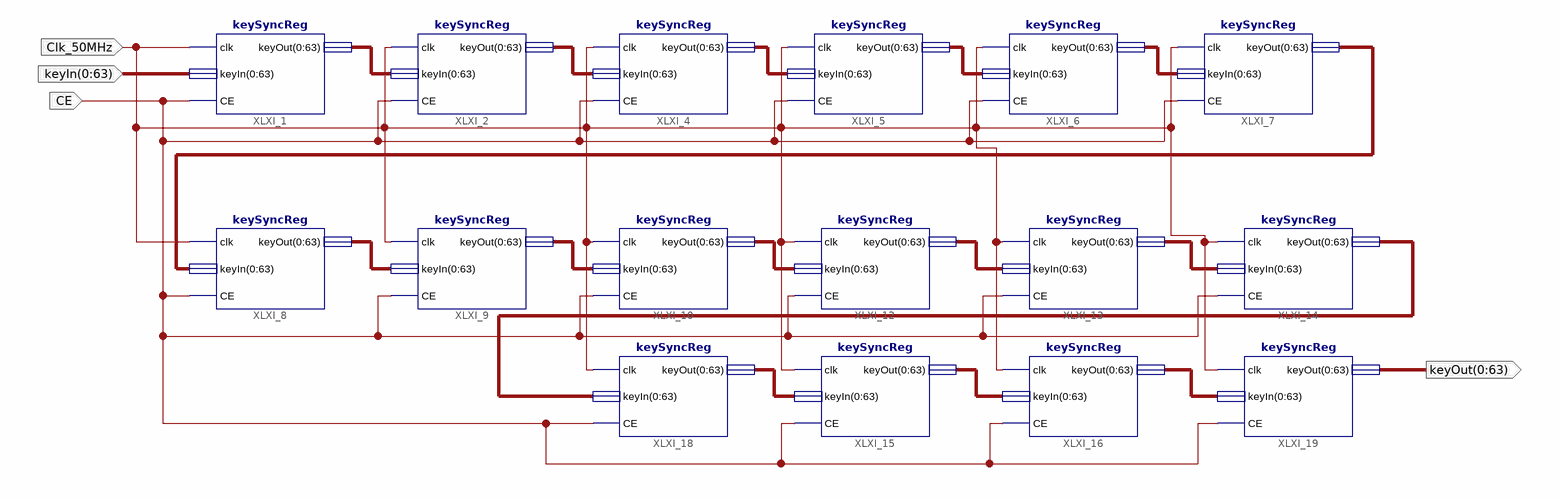
[diagram p0: schematic sheet 1]
// Xilinx ISE schematic keyBuffer.sch (spartan3e) as structural Verilog: 16 symbols, 4 ports
module keyBuffer (
  input  [0:63] keyIn,
  input  Clk_50MHz,
  input  CE,
  output [0:63] keyOut
);

  wire [63:0] XLXN_4, XLXN_5, XLXN_6, XLXN_9, XLXN_10, XLXN_11, XLXN_13, XLXN_14, XLXN_15, XLXN_16, XLXN_17,
       XLXN_18, XLXN_20, XLXN_21, XLXN_56;

  keySyncReg XLXI_1 (
    .clk(Clk_50MHz), .keyIn(keyIn),
    .keyOut({XLXN_4[0], XLXN_4[1], XLXN_4[2], XLXN_4[3], XLXN_4[4], XLXN_4[5], XLXN_4[6], XLXN_4[7], XLXN_4[8], XLXN_4[9], XLXN_4[10], XLXN_4[11], XLXN_4[12], XLXN_4[13], XLXN_4[14], XLXN_4[15], XLXN_4[16], XLXN_4[17], XLXN_4[18], XLXN_4[19], XLXN_4[20], XLXN_4[21], XLXN_4[22], XLXN_4[23], XLXN_4[24], XLXN_4[25], XLXN_4[26], XLXN_4[27], XLXN_4[28], XLXN_4[29], XLXN_4[30], XLXN_4[31], XLXN_4[32], XLXN_4[33], XLXN_4[34], XLXN_4[35], XLXN_4[36], XLXN_4[37], XLXN_4[38], XLXN_4[39], XLXN_4[40], XLXN_4[41], XLXN_4[42], XLXN_4[43], XLXN_4[44], XLXN_4[45], XLXN_4[46], XLXN_4[47], XLXN_4[48], XLXN_4[49], XLXN_4[50], XLXN_4[51], XLXN_4[52], XLXN_4[53], XLXN_4[54], XLXN_4[55], XLXN_4[56], XLXN_4[57], XLXN_4[58], XLXN_4[59], XLXN_4[60], XLXN_4[61], XLXN_4[62], XLXN_4[63]}),
    .CE(CE));
  keySyncReg XLXI_2 (
    .clk(Clk_50MHz),
    .keyIn({XLXN_4[0], XLXN_4[1], XLXN_4[2], XLXN_4[3], XLXN_4[4], XLXN_4[5], XLXN_4[6], XLXN_4[7], XLXN_4[8], XLXN_4[9], XLXN_4[10], XLXN_4[11], XLXN_4[12], XLXN_4[13], XLXN_4[14], XLXN_4[15], XLXN_4[16], XLXN_4[17], XLXN_4[18], XLXN_4[19], XLXN_4[20], XLXN_4[21], XLXN_4[22], XLXN_4[23], XLXN_4[24], XLXN_4[25], XLXN_4[26], XLXN_4[27], XLXN_4[28], XLXN_4[29], XLXN_4[30], XLXN_4[31], XLXN_4[32], XLXN_4[33], XLXN_4[34], XLXN_4[35], XLXN_4[36], XLXN_4[37], XLXN_4[38], XLXN_4[39], XLXN_4[40], XLXN_4[41], XLXN_4[42], XLXN_4[43], XLXN_4[44], XLXN_4[45], XLXN_4[46], XLXN_4[47], XLXN_4[48], XLXN_4[49], XLXN_4[50], XLXN_4[51], XLXN_4[52], XLXN_4[53], XLXN_4[54], XLXN_4[55], XLXN_4[56], XLXN_4[57], XLXN_4[58], XLXN_4[59], XLXN_4[60], XLXN_4[61], XLXN_4[62], XLXN_4[63]}),
    .keyOut({XLXN_5[0], XLXN_5[1], XLXN_5[2], XLXN_5[3], XLXN_5[4], XLXN_5[5], XLXN_5[6], XLXN_5[7], XLXN_5[8], XLXN_5[9], XLXN_5[10], XLXN_5[11], XLXN_5[12], XLXN_5[13], XLXN_5[14], XLXN_5[15], XLXN_5[16], XLXN_5[17], XLXN_5[18], XLXN_5[19], XLXN_5[20], XLXN_5[21], XLXN_5[22], XLXN_5[23], XLXN_5[24], XLXN_5[25], XLXN_5[26], XLXN_5[27], XLXN_5[28], XLXN_5[29], XLXN_5[30], XLXN_5[31], XLXN_5[32], XLXN_5[33], XLXN_5[34], XLXN_5[35], XLXN_5[36], XLXN_5[37], XLXN_5[38], XLXN_5[39], XLXN_5[40], XLXN_5[41], XLXN_5[42], XLXN_5[43], XLXN_5[44], XLXN_5[45], XLXN_5[46], XLXN_5[47], XLXN_5[48], XLXN_5[49], XLXN_5[50], XLXN_5[51], XLXN_5[52], XLXN_5[53], XLXN_5[54], XLXN_5[55], XLXN_5[56], XLXN_5[57], XLXN_5[58], XLXN_5[59], XLXN_5[60], XLXN_5[61], XLXN_5[62], XLXN_5[63]}),
    .CE(CE));
  keySyncReg XLXI_4 (
    .clk(Clk_50MHz),
    .keyIn({XLXN_5[0], XLXN_5[1], XLXN_5[2], XLXN_5[3], XLXN_5[4], XLXN_5[5], XLXN_5[6], XLXN_5[7], XLXN_5[8], XLXN_5[9], XLXN_5[10], XLXN_5[11], XLXN_5[12], XLXN_5[13], XLXN_5[14], XLXN_5[15], XLXN_5[16], XLXN_5[17], XLXN_5[18], XLXN_5[19], XLXN_5[20], XLXN_5[21], XLXN_5[22], XLXN_5[23], XLXN_5[24], XLXN_5[25], XLXN_5[26], XLXN_5[27], XLXN_5[28], XLXN_5[29], XLXN_5[30], XLXN_5[31], XLXN_5[32], XLXN_5[33], XLXN_5[34], XLXN_5[35], XLXN_5[36], XLXN_5[37], XLXN_5[38], XLXN_5[39], XLXN_5[40], XLXN_5[41], XLXN_5[42], XLXN_5[43], XLXN_5[44], XLXN_5[45], XLXN_5[46], XLXN_5[47], XLXN_5[48], XLXN_5[49], XLXN_5[50], XLXN_5[51], XLXN_5[52], XLXN_5[53], XLXN_5[54], XLXN_5[55], XLXN_5[56], XLXN_5[57], XLXN_5[58], XLXN_5[59], XLXN_5[60], XLXN_5[61], XLXN_5[62], XLXN_5[63]}),
    .keyOut({XLXN_6[0], XLXN_6[1], XLXN_6[2], XLXN_6[3], XLXN_6[4], XLXN_6[5], XLXN_6[6], XLXN_6[7], XLXN_6[8], XLXN_6[9], XLXN_6[10], XLXN_6[11], XLXN_6[12], XLXN_6[13], XLXN_6[14], XLXN_6[15], XLXN_6[16], XLXN_6[17], XLXN_6[18], XLXN_6[19], XLXN_6[20], XLXN_6[21], XLXN_6[22], XLXN_6[23], XLXN_6[24], XLXN_6[25], XLXN_6[26], XLXN_6[27], XLXN_6[28], XLXN_6[29], XLXN_6[30], XLXN_6[31], XLXN_6[32], XLXN_6[33], XLXN_6[34], XLXN_6[35], XLXN_6[36], XLXN_6[37], XLXN_6[38], XLXN_6[39], XLXN_6[40], XLXN_6[41], XLXN_6[42], XLXN_6[43], XLXN_6[44], XLXN_6[45], XLXN_6[46], XLXN_6[47], XLXN_6[48], XLXN_6[49], XLXN_6[50], XLXN_6[51], XLXN_6[52], XLXN_6[53], XLXN_6[54], XLXN_6[55], XLXN_6[56], XLXN_6[57], XLXN_6[58], XLXN_6[59], XLXN_6[60], XLXN_6[61], XLXN_6[62], XLXN_6[63]}),
    .CE(CE));
  keySyncReg XLXI_5 (
    .clk(Clk_50MHz),
    .keyIn({XLXN_6[0], XLXN_6[1], XLXN_6[2], XLXN_6[3], XLXN_6[4], XLXN_6[5], XLXN_6[6], XLXN_6[7], XLXN_6[8], XLXN_6[9], XLXN_6[10], XLXN_6[11], XLXN_6[12], XLXN_6[13], XLXN_6[14], XLXN_6[15], XLXN_6[16], XLXN_6[17], XLXN_6[18], XLXN_6[19], XLXN_6[20], XLXN_6[21], XLXN_6[22], XLXN_6[23], XLXN_6[24], XLXN_6[25], XLXN_6[26], XLXN_6[27], XLXN_6[28], XLXN_6[29], XLXN_6[30], XLXN_6[31], XLXN_6[32], XLXN_6[33], XLXN_6[34], XLXN_6[35], XLXN_6[36], XLXN_6[37], XLXN_6[38], XLXN_6[39], XLXN_6[40], XLXN_6[41], XLXN_6[42], XLXN_6[43], XLXN_6[44], XLXN_6[45], XLXN_6[46], XLXN_6[47], XLXN_6[48], XLXN_6[49], XLXN_6[50], XLXN_6[51], XLXN_6[52], XLXN_6[53], XLXN_6[54], XLXN_6[55], XLXN_6[56], XLXN_6[57], XLXN_6[58], XLXN_6[59], XLXN_6[60], XLXN_6[61], XLXN_6[62], XLXN_6[63]}),
    .keyOut({XLXN_9[0], XLXN_9[1], XLXN_9[2], XLXN_9[3], XLXN_9[4], XLXN_9[5], XLXN_9[6], XLXN_9[7], XLXN_9[8], XLXN_9[9], XLXN_9[10], XLXN_9[11], XLXN_9[12], XLXN_9[13], XLXN_9[14], XLXN_9[15], XLXN_9[16], XLXN_9[17], XLXN_9[18], XLXN_9[19], XLXN_9[20], XLXN_9[21], XLXN_9[22], XLXN_9[23], XLXN_9[24], XLXN_9[25], XLXN_9[26], XLXN_9[27], XLXN_9[28], XLXN_9[29], XLXN_9[30], XLXN_9[31], XLXN_9[32], XLXN_9[33], XLXN_9[34], XLXN_9[35], XLXN_9[36], XLXN_9[37], XLXN_9[38], XLXN_9[39], XLXN_9[40], XLXN_9[41], XLXN_9[42], XLXN_9[43], XLXN_9[44], XLXN_9[45], XLXN_9[46], XLXN_9[47], XLXN_9[48], XLXN_9[49], XLXN_9[50], XLXN_9[51], XLXN_9[52], XLXN_9[53], XLXN_9[54], XLXN_9[55], XLXN_9[56], XLXN_9[57], XLXN_9[58], XLXN_9[59], XLXN_9[60], XLXN_9[61], XLXN_9[62], XLXN_9[63]}),
    .CE(CE));
  keySyncReg XLXI_6 (
    .clk(Clk_50MHz),
    .keyIn({XLXN_9[0], XLXN_9[1], XLXN_9[2], XLXN_9[3], XLXN_9[4], XLXN_9[5], XLXN_9[6], XLXN_9[7], XLXN_9[8], XLXN_9[9], XLXN_9[10], XLXN_9[11], XLXN_9[12], XLXN_9[13], XLXN_9[14], XLXN_9[15], XLXN_9[16], XLXN_9[17], XLXN_9[18], XLXN_9[19], XLXN_9[20], XLXN_9[21], XLXN_9[22], XLXN_9[23], XLXN_9[24], XLXN_9[25], XLXN_9[26], XLXN_9[27], XLXN_9[28], XLXN_9[29], XLXN_9[30], XLXN_9[31], XLXN_9[32], XLXN_9[33], XLXN_9[34], XLXN_9[35], XLXN_9[36], XLXN_9[37], XLXN_9[38], XLXN_9[39], XLXN_9[40], XLXN_9[41], XLXN_9[42], XLXN_9[43], XLXN_9[44], XLXN_9[45], XLXN_9[46], XLXN_9[47], XLXN_9[48], XLXN_9[49], XLXN_9[50], XLXN_9[51], XLXN_9[52], XLXN_9[53], XLXN_9[54], XLXN_9[55], XLXN_9[56], XLXN_9[57], XLXN_9[58], XLXN_9[59], XLXN_9[60], XLXN_9[61], XLXN_9[62], XLXN_9[63]}),
    .keyOut({XLXN_10[0], XLXN_10[1], XLXN_10[2], XLXN_10[3], XLXN_10[4], XLXN_10[5], XLXN_10[6], XLXN_10[7], XLXN_10[8], XLXN_10[9], XLXN_10[10], XLXN_10[11], XLXN_10[12], XLXN_10[13], XLXN_10[14], XLXN_10[15], XLXN_10[16], XLXN_10[17], XLXN_10[18], XLXN_10[19], XLXN_10[20], XLXN_10[21], XLXN_10[22], XLXN_10[23], XLXN_10[24], XLXN_10[25], XLXN_10[26], XLXN_10[27], XLXN_10[28], XLXN_10[29], XLXN_10[30], XLXN_10[31], XLXN_10[32], XLXN_10[33], XLXN_10[34], XLXN_10[35], XLXN_10[36], XLXN_10[37], XLXN_10[38], XLXN_10[39], XLXN_10[40], XLXN_10[41], XLXN_10[42], XLXN_10[43], XLXN_10[44], XLXN_10[45], XLXN_10[46], XLXN_10[47], XLXN_10[48], XLXN_10[49], XLXN_10[50], XLXN_10[51], XLXN_10[52], XLXN_10[53], XLXN_10[54], XLXN_10[55], XLXN_10[56], XLXN_10[57], XLXN_10[58], XLXN_10[59], XLXN_10[60], XLXN_10[61], XLXN_10[62], XLXN_10[63]}),
    .CE(CE));
  keySyncReg XLXI_7 (
    .clk(Clk_50MHz),
    .keyIn({XLXN_10[0], XLXN_10[1], XLXN_10[2], XLXN_10[3], XLXN_10[4], XLXN_10[5], XLXN_10[6], XLXN_10[7], XLXN_10[8], XLXN_10[9], XLXN_10[10], XLXN_10[11], XLXN_10[12], XLXN_10[13], XLXN_10[14], XLXN_10[15], XLXN_10[16], XLXN_10[17], XLXN_10[18], XLXN_10[19], XLXN_10[20], XLXN_10[21], XLXN_10[22], XLXN_10[23], XLXN_10[24], XLXN_10[25], XLXN_10[26], XLXN_10[27], XLXN_10[28], XLXN_10[29], XLXN_10[30], XLXN_10[31], XLXN_10[32], XLXN_10[33], XLXN_10[34], XLXN_10[35], XLXN_10[36], XLXN_10[37], XLXN_10[38], XLXN_10[39], XLXN_10[40], XLXN_10[41], XLXN_10[42], XLXN_10[43], XLXN_10[44], XLXN_10[45], XLXN_10[46], XLXN_10[47], XLXN_10[48], XLXN_10[49], XLXN_10[50], XLXN_10[51], XLXN_10[52], XLXN_10[53], XLXN_10[54], XLXN_10[55], XLXN_10[56], XLXN_10[57], XLXN_10[58], XLXN_10[59], XLXN_10[60], XLXN_10[61], XLXN_10[62], XLXN_10[63]}),
    .keyOut({XLXN_11[0], XLXN_11[1], XLXN_11[2], XLXN_11[3], XLXN_11[4], XLXN_11[5], XLXN_11[6], XLXN_11[7], XLXN_11[8], XLXN_11[9], XLXN_11[10], XLXN_11[11], XLXN_11[12], XLXN_11[13], XLXN_11[14], XLXN_11[15], XLXN_11[16], XLXN_11[17], XLXN_11[18], XLXN_11[19], XLXN_11[20], XLXN_11[21], XLXN_11[22], XLXN_11[23], XLXN_11[24], XLXN_11[25], XLXN_11[26], XLXN_11[27], XLXN_11[28], XLXN_11[29], XLXN_11[30], XLXN_11[31], XLXN_11[32], XLXN_11[33], XLXN_11[34], XLXN_11[35], XLXN_11[36], XLXN_11[37], XLXN_11[38], XLXN_11[39], XLXN_11[40], XLXN_11[41], XLXN_11[42], XLXN_11[43], XLXN_11[44], XLXN_11[45], XLXN_11[46], XLXN_11[47], XLXN_11[48], XLXN_11[49], XLXN_11[50], XLXN_11[51], XLXN_11[52], XLXN_11[53], XLXN_11[54], XLXN_11[55], XLXN_11[56], XLXN_11[57], XLXN_11[58], XLXN_11[59], XLXN_11[60], XLXN_11[61], XLXN_11[62], XLXN_11[63]}),
    .CE(CE));
  keySyncReg XLXI_8 (
    .clk(Clk_50MHz),
    .keyIn({XLXN_11[0], XLXN_11[1], XLXN_11[2], XLXN_11[3], XLXN_11[4], XLXN_11[5], XLXN_11[6], XLXN_11[7], XLXN_11[8], XLXN_11[9], XLXN_11[10], XLXN_11[11], XLXN_11[12], XLXN_11[13], XLXN_11[14], XLXN_11[15], XLXN_11[16], XLXN_11[17], XLXN_11[18], XLXN_11[19], XLXN_11[20], XLXN_11[21], XLXN_11[22], XLXN_11[23], XLXN_11[24], XLXN_11[25], XLXN_11[26], XLXN_11[27], XLXN_11[28], XLXN_11[29], XLXN_11[30], XLXN_11[31], XLXN_11[32], XLXN_11[33], XLXN_11[34], XLXN_11[35], XLXN_11[36], XLXN_11[37], XLXN_11[38], XLXN_11[39], XLXN_11[40], XLXN_11[41], XLXN_11[42], XLXN_11[43], XLXN_11[44], XLXN_11[45], XLXN_11[46], XLXN_11[47], XLXN_11[48], XLXN_11[49], XLXN_11[50], XLXN_11[51], XLXN_11[52], XLXN_11[53], XLXN_11[54], XLXN_11[55], XLXN_11[56], XLXN_11[57], XLXN_11[58], XLXN_11[59], XLXN_11[60], XLXN_11[61], XLXN_11[62], XLXN_11[63]}),
    .keyOut({XLXN_13[0], XLXN_13[1], XLXN_13[2], XLXN_13[3], XLXN_13[4], XLXN_13[5], XLXN_13[6], XLXN_13[7], XLXN_13[8], XLXN_13[9], XLXN_13[10], XLXN_13[11], XLXN_13[12], XLXN_13[13], XLXN_13[14], XLXN_13[15], XLXN_13[16], XLXN_13[17], XLXN_13[18], XLXN_13[19], XLXN_13[20], XLXN_13[21], XLXN_13[22], XLXN_13[23], XLXN_13[24], XLXN_13[25], XLXN_13[26], XLXN_13[27], XLXN_13[28], XLXN_13[29], XLXN_13[30], XLXN_13[31], XLXN_13[32], XLXN_13[33], XLXN_13[34], XLXN_13[35], XLXN_13[36], XLXN_13[37], XLXN_13[38], XLXN_13[39], XLXN_13[40], XLXN_13[41], XLXN_13[42], XLXN_13[43], XLXN_13[44], XLXN_13[45], XLXN_13[46], XLXN_13[47], XLXN_13[48], XLXN_13[49], XLXN_13[50], XLXN_13[51], XLXN_13[52], XLXN_13[53], XLXN_13[54], XLXN_13[55], XLXN_13[56], XLXN_13[57], XLXN_13[58], XLXN_13[59], XLXN_13[60], XLXN_13[61], XLXN_13[62], XLXN_13[63]}),
    .CE(CE));
  keySyncReg XLXI_9 (
    .clk(Clk_50MHz),
    .keyIn({XLXN_13[0], XLXN_13[1], XLXN_13[2], XLXN_13[3], XLXN_13[4], XLXN_13[5], XLXN_13[6], XLXN_13[7], XLXN_13[8], XLXN_13[9], XLXN_13[10], XLXN_13[11], XLXN_13[12], XLXN_13[13], XLXN_13[14], XLXN_13[15], XLXN_13[16], XLXN_13[17], XLXN_13[18], XLXN_13[19], XLXN_13[20], XLXN_13[21], XLXN_13[22], XLXN_13[23], XLXN_13[24], XLXN_13[25], XLXN_13[26], XLXN_13[27], XLXN_13[28], XLXN_13[29], XLXN_13[30], XLXN_13[31], XLXN_13[32], XLXN_13[33], XLXN_13[34], XLXN_13[35], XLXN_13[36], XLXN_13[37], XLXN_13[38], XLXN_13[39], XLXN_13[40], XLXN_13[41], XLXN_13[42], XLXN_13[43], XLXN_13[44], XLXN_13[45], XLXN_13[46], XLXN_13[47], XLXN_13[48], XLXN_13[49], XLXN_13[50], XLXN_13[51], XLXN_13[52], XLXN_13[53], XLXN_13[54], XLXN_13[55], XLXN_13[56], XLXN_13[57], XLXN_13[58], XLXN_13[59], XLXN_13[60], XLXN_13[61], XLXN_13[62], XLXN_13[63]}),
    .keyOut({XLXN_14[0], XLXN_14[1], XLXN_14[2], XLXN_14[3], XLXN_14[4], XLXN_14[5], XLXN_14[6], XLXN_14[7], XLXN_14[8], XLXN_14[9], XLXN_14[10], XLXN_14[11], XLXN_14[12], XLXN_14[13], XLXN_14[14], XLXN_14[15], XLXN_14[16], XLXN_14[17], XLXN_14[18], XLXN_14[19], XLXN_14[20], XLXN_14[21], XLXN_14[22], XLXN_14[23], XLXN_14[24], XLXN_14[25], XLXN_14[26], XLXN_14[27], XLXN_14[28], XLXN_14[29], XLXN_14[30], XLXN_14[31], XLXN_14[32], XLXN_14[33], XLXN_14[34], XLXN_14[35], XLXN_14[36], XLXN_14[37], XLXN_14[38], XLXN_14[39], XLXN_14[40], XLXN_14[41], XLXN_14[42], XLXN_14[43], XLXN_14[44], XLXN_14[45], XLXN_14[46], XLXN_14[47], XLXN_14[48], XLXN_14[49], XLXN_14[50], XLXN_14[51], XLXN_14[52], XLXN_14[53], XLXN_14[54], XLXN_14[55], XLXN_14[56], XLXN_14[57], XLXN_14[58], XLXN_14[59], XLXN_14[60], XLXN_14[61], XLXN_14[62], XLXN_14[63]}),
    .CE(CE));
  keySyncReg XLXI_10 (
    .clk(Clk_50MHz),
    .keyIn({XLXN_14[0], XLXN_14[1], XLXN_14[2], XLXN_14[3], XLXN_14[4], XLXN_14[5], XLXN_14[6], XLXN_14[7], XLXN_14[8], XLXN_14[9], XLXN_14[10], XLXN_14[11], XLXN_14[12], XLXN_14[13], XLXN_14[14], XLXN_14[15], XLXN_14[16], XLXN_14[17], XLXN_14[18], XLXN_14[19], XLXN_14[20], XLXN_14[21], XLXN_14[22], XLXN_14[23], XLXN_14[24], XLXN_14[25], XLXN_14[26], XLXN_14[27], XLXN_14[28], XLXN_14[29], XLXN_14[30], XLXN_14[31], XLXN_14[32], XLXN_14[33], XLXN_14[34], XLXN_14[35], XLXN_14[36], XLXN_14[37], XLXN_14[38], XLXN_14[39], XLXN_14[40], XLXN_14[41], XLXN_14[42], XLXN_14[43], XLXN_14[44], XLXN_14[45], XLXN_14[46], XLXN_14[47], XLXN_14[48], XLXN_14[49], XLXN_14[50], XLXN_14[51], XLXN_14[52], XLXN_14[53], XLXN_14[54], XLXN_14[55], XLXN_14[56], XLXN_14[57], XLXN_14[58], XLXN_14[59], XLXN_14[60], XLXN_14[61], XLXN_14[62], XLXN_14[63]}),
    .keyOut({XLXN_15[0], XLXN_15[1], XLXN_15[2], XLXN_15[3], XLXN_15[4], XLXN_15[5], XLXN_15[6], XLXN_15[7], XLXN_15[8], XLXN_15[9], XLXN_15[10], XLXN_15[11], XLXN_15[12], XLXN_15[13], XLXN_15[14], XLXN_15[15], XLXN_15[16], XLXN_15[17], XLXN_15[18], XLXN_15[19], XLXN_15[20], XLXN_15[21], XLXN_15[22], XLXN_15[23], XLXN_15[24], XLXN_15[25], XLXN_15[26], XLXN_15[27], XLXN_15[28], XLXN_15[29], XLXN_15[30], XLXN_15[31], XLXN_15[32], XLXN_15[33], XLXN_15[34], XLXN_15[35], XLXN_15[36], XLXN_15[37], XLXN_15[38], XLXN_15[39], XLXN_15[40], XLXN_15[41], XLXN_15[42], XLXN_15[43], XLXN_15[44], XLXN_15[45], XLXN_15[46], XLXN_15[47], XLXN_15[48], XLXN_15[49], XLXN_15[50], XLXN_15[51], XLXN_15[52], XLXN_15[53], XLXN_15[54], XLXN_15[55], XLXN_15[56], XLXN_15[57], XLXN_15[58], XLXN_15[59], XLXN_15[60], XLXN_15[61], XLXN_15[62], XLXN_15[63]}),
    .CE(CE));
  keySyncReg XLXI_12 (
    .clk(Clk_50MHz),
    .keyIn({XLXN_15[0], XLXN_15[1], XLXN_15[2], XLXN_15[3], XLXN_15[4], XLXN_15[5], XLXN_15[6], XLXN_15[7], XLXN_15[8], XLXN_15[9], XLXN_15[10], XLXN_15[11], XLXN_15[12], XLXN_15[13], XLXN_15[14], XLXN_15[15], XLXN_15[16], XLXN_15[17], XLXN_15[18], XLXN_15[19], XLXN_15[20], XLXN_15[21], XLXN_15[22], XLXN_15[23], XLXN_15[24], XLXN_15[25], XLXN_15[26], XLXN_15[27], XLXN_15[28], XLXN_15[29], XLXN_15[30], XLXN_15[31], XLXN_15[32], XLXN_15[33], XLXN_15[34], XLXN_15[35], XLXN_15[36], XLXN_15[37], XLXN_15[38], XLXN_15[39], XLXN_15[40], XLXN_15[41], XLXN_15[42], XLXN_15[43], XLXN_15[44], XLXN_15[45], XLXN_15[46], XLXN_15[47], XLXN_15[48], XLXN_15[49], XLXN_15[50], XLXN_15[51], XLXN_15[52], XLXN_15[53], XLXN_15[54], XLXN_15[55], XLXN_15[56], XLXN_15[57], XLXN_15[58], XLXN_15[59], XLXN_15[60], XLXN_15[61], XLXN_15[62], XLXN_15[63]}),
    .keyOut({XLXN_16[0], XLXN_16[1], XLXN_16[2], XLXN_16[3], XLXN_16[4], XLXN_16[5], XLXN_16[6], XLXN_16[7], XLXN_16[8], XLXN_16[9], XLXN_16[10], XLXN_16[11], XLXN_16[12], XLXN_16[13], XLXN_16[14], XLXN_16[15], XLXN_16[16], XLXN_16[17], XLXN_16[18], XLXN_16[19], XLXN_16[20], XLXN_16[21], XLXN_16[22], XLXN_16[23], XLXN_16[24], XLXN_16[25], XLXN_16[26], XLXN_16[27], XLXN_16[28], XLXN_16[29], XLXN_16[30], XLXN_16[31], XLXN_16[32], XLXN_16[33], XLXN_16[34], XLXN_16[35], XLXN_16[36], XLXN_16[37], XLXN_16[38], XLXN_16[39], XLXN_16[40], XLXN_16[41], XLXN_16[42], XLXN_16[43], XLXN_16[44], XLXN_16[45], XLXN_16[46], XLXN_16[47], XLXN_16[48], XLXN_16[49], XLXN_16[50], XLXN_16[51], XLXN_16[52], XLXN_16[53], XLXN_16[54], XLXN_16[55], XLXN_16[56], XLXN_16[57], XLXN_16[58], XLXN_16[59], XLXN_16[60], XLXN_16[61], XLXN_16[62], XLXN_16[63]}),
    .CE(CE));
  keySyncReg XLXI_13 (
    .clk(Clk_50MHz),
    .keyIn({XLXN_16[0], XLXN_16[1], XLXN_16[2], XLXN_16[3], XLXN_16[4], XLXN_16[5], XLXN_16[6], XLXN_16[7], XLXN_16[8], XLXN_16[9], XLXN_16[10], XLXN_16[11], XLXN_16[12], XLXN_16[13], XLXN_16[14], XLXN_16[15], XLXN_16[16], XLXN_16[17], XLXN_16[18], XLXN_16[19], XLXN_16[20], XLXN_16[21], XLXN_16[22], XLXN_16[23], XLXN_16[24], XLXN_16[25], XLXN_16[26], XLXN_16[27], XLXN_16[28], XLXN_16[29], XLXN_16[30], XLXN_16[31], XLXN_16[32], XLXN_16[33], XLXN_16[34], XLXN_16[35], XLXN_16[36], XLXN_16[37], XLXN_16[38], XLXN_16[39], XLXN_16[40], XLXN_16[41], XLXN_16[42], XLXN_16[43], XLXN_16[44], XLXN_16[45], XLXN_16[46], XLXN_16[47], XLXN_16[48], XLXN_16[49], XLXN_16[50], XLXN_16[51], XLXN_16[52], XLXN_16[53], XLXN_16[54], XLXN_16[55], XLXN_16[56], XLXN_16[57], XLXN_16[58], XLXN_16[59], XLXN_16[60], XLXN_16[61], XLXN_16[62], XLXN_16[63]}),
    .keyOut({XLXN_17[0], XLXN_17[1], XLXN_17[2], XLXN_17[3], XLXN_17[4], XLXN_17[5], XLXN_17[6], XLXN_17[7], XLXN_17[8], XLXN_17[9], XLXN_17[10], XLXN_17[11], XLXN_17[12], XLXN_17[13], XLXN_17[14], XLXN_17[15], XLXN_17[16], XLXN_17[17], XLXN_17[18], XLXN_17[19], XLXN_17[20], XLXN_17[21], XLXN_17[22], XLXN_17[23], XLXN_17[24], XLXN_17[25], XLXN_17[26], XLXN_17[27], XLXN_17[28], XLXN_17[29], XLXN_17[30], XLXN_17[31], XLXN_17[32], XLXN_17[33], XLXN_17[34], XLXN_17[35], XLXN_17[36], XLXN_17[37], XLXN_17[38], XLXN_17[39], XLXN_17[40], XLXN_17[41], XLXN_17[42], XLXN_17[43], XLXN_17[44], XLXN_17[45], XLXN_17[46], XLXN_17[47], XLXN_17[48], XLXN_17[49], XLXN_17[50], XLXN_17[51], XLXN_17[52], XLXN_17[53], XLXN_17[54], XLXN_17[55], XLXN_17[56], XLXN_17[57], XLXN_17[58], XLXN_17[59], XLXN_17[60], XLXN_17[61], XLXN_17[62], XLXN_17[63]}),
    .CE(CE));
  keySyncReg XLXI_14 (
    .clk(Clk_50MHz),
    .keyIn({XLXN_17[0], XLXN_17[1], XLXN_17[2], XLXN_17[3], XLXN_17[4], XLXN_17[5], XLXN_17[6], XLXN_17[7], XLXN_17[8], XLXN_17[9], XLXN_17[10], XLXN_17[11], XLXN_17[12], XLXN_17[13], XLXN_17[14], XLXN_17[15], XLXN_17[16], XLXN_17[17], XLXN_17[18], XLXN_17[19], XLXN_17[20], XLXN_17[21], XLXN_17[22], XLXN_17[23], XLXN_17[24], XLXN_17[25], XLXN_17[26], XLXN_17[27], XLXN_17[28], XLXN_17[29], XLXN_17[30], XLXN_17[31], XLXN_17[32], XLXN_17[33], XLXN_17[34], XLXN_17[35], XLXN_17[36], XLXN_17[37], XLXN_17[38], XLXN_17[39], XLXN_17[40], XLXN_17[41], XLXN_17[42], XLXN_17[43], XLXN_17[44], XLXN_17[45], XLXN_17[46], XLXN_17[47], XLXN_17[48], XLXN_17[49], XLXN_17[50], XLXN_17[51], XLXN_17[52], XLXN_17[53], XLXN_17[54], XLXN_17[55], XLXN_17[56], XLXN_17[57], XLXN_17[58], XLXN_17[59], XLXN_17[60], XLXN_17[61], XLXN_17[62], XLXN_17[63]}),
    .keyOut({XLXN_18[0], XLXN_18[1], XLXN_18[2], XLXN_18[3], XLXN_18[4], XLXN_18[5], XLXN_18[6], XLXN_18[7], XLXN_18[8], XLXN_18[9], XLXN_18[10], XLXN_18[11], XLXN_18[12], XLXN_18[13], XLXN_18[14], XLXN_18[15], XLXN_18[16], XLXN_18[17], XLXN_18[18], XLXN_18[19], XLXN_18[20], XLXN_18[21], XLXN_18[22], XLXN_18[23], XLXN_18[24], XLXN_18[25], XLXN_18[26], XLXN_18[27], XLXN_18[28], XLXN_18[29], XLXN_18[30], XLXN_18[31], XLXN_18[32], XLXN_18[33], XLXN_18[34], XLXN_18[35], XLXN_18[36], XLXN_18[37], XLXN_18[38], XLXN_18[39], XLXN_18[40], XLXN_18[41], XLXN_18[42], XLXN_18[43], XLXN_18[44], XLXN_18[45], XLXN_18[46], XLXN_18[47], XLXN_18[48], XLXN_18[49], XLXN_18[50], XLXN_18[51], XLXN_18[52], XLXN_18[53], XLXN_18[54], XLXN_18[55], XLXN_18[56], XLXN_18[57], XLXN_18[58], XLXN_18[59], XLXN_18[60], XLXN_18[61], XLXN_18[62], XLXN_18[63]}),
    .CE(CE));
  keySyncReg XLXI_15 (
    .clk(Clk_50MHz),
    .keyIn({XLXN_20[0], XLXN_20[1], XLXN_20[2], XLXN_20[3], XLXN_20[4], XLXN_20[5], XLXN_20[6], XLXN_20[7], XLXN_20[8], XLXN_20[9], XLXN_20[10], XLXN_20[11], XLXN_20[12], XLXN_20[13], XLXN_20[14], XLXN_20[15], XLXN_20[16], XLXN_20[17], XLXN_20[18], XLXN_20[19], XLXN_20[20], XLXN_20[21], XLXN_20[22], XLXN_20[23], XLXN_20[24], XLXN_20[25], XLXN_20[26], XLXN_20[27], XLXN_20[28], XLXN_20[29], XLXN_20[30], XLXN_20[31], XLXN_20[32], XLXN_20[33], XLXN_20[34], XLXN_20[35], XLXN_20[36], XLXN_20[37], XLXN_20[38], XLXN_20[39], XLXN_20[40], XLXN_20[41], XLXN_20[42], XLXN_20[43], XLXN_20[44], XLXN_20[45], XLXN_20[46], XLXN_20[47], XLXN_20[48], XLXN_20[49], XLXN_20[50], XLXN_20[51], XLXN_20[52], XLXN_20[53], XLXN_20[54], XLXN_20[55], XLXN_20[56], XLXN_20[57], XLXN_20[58], XLXN_20[59], XLXN_20[60], XLXN_20[61], XLXN_20[62], XLXN_20[63]}),
    .keyOut({XLXN_21[0], XLXN_21[1], XLXN_21[2], XLXN_21[3], XLXN_21[4], XLXN_21[5], XLXN_21[6], XLXN_21[7], XLXN_21[8], XLXN_21[9], XLXN_21[10], XLXN_21[11], XLXN_21[12], XLXN_21[13], XLXN_21[14], XLXN_21[15], XLXN_21[16], XLXN_21[17], XLXN_21[18], XLXN_21[19], XLXN_21[20], XLXN_21[21], XLXN_21[22], XLXN_21[23], XLXN_21[24], XLXN_21[25], XLXN_21[26], XLXN_21[27], XLXN_21[28], XLXN_21[29], XLXN_21[30], XLXN_21[31], XLXN_21[32], XLXN_21[33], XLXN_21[34], XLXN_21[35], XLXN_21[36], XLXN_21[37], XLXN_21[38], XLXN_21[39], XLXN_21[40], XLXN_21[41], XLXN_21[42], XLXN_21[43], XLXN_21[44], XLXN_21[45], XLXN_21[46], XLXN_21[47], XLXN_21[48], XLXN_21[49], XLXN_21[50], XLXN_21[51], XLXN_21[52], XLXN_21[53], XLXN_21[54], XLXN_21[55], XLXN_21[56], XLXN_21[57], XLXN_21[58], XLXN_21[59], XLXN_21[60], XLXN_21[61], XLXN_21[62], XLXN_21[63]}),
    .CE(CE));
  keySyncReg XLXI_16 (
    .clk(Clk_50MHz),
    .keyIn({XLXN_21[0], XLXN_21[1], XLXN_21[2], XLXN_21[3], XLXN_21[4], XLXN_21[5], XLXN_21[6], XLXN_21[7], XLXN_21[8], XLXN_21[9], XLXN_21[10], XLXN_21[11], XLXN_21[12], XLXN_21[13], XLXN_21[14], XLXN_21[15], XLXN_21[16], XLXN_21[17], XLXN_21[18], XLXN_21[19], XLXN_21[20], XLXN_21[21], XLXN_21[22], XLXN_21[23], XLXN_21[24], XLXN_21[25], XLXN_21[26], XLXN_21[27], XLXN_21[28], XLXN_21[29], XLXN_21[30], XLXN_21[31], XLXN_21[32], XLXN_21[33], XLXN_21[34], XLXN_21[35], XLXN_21[36], XLXN_21[37], XLXN_21[38], XLXN_21[39], XLXN_21[40], XLXN_21[41], XLXN_21[42], XLXN_21[43], XLXN_21[44], XLXN_21[45], XLXN_21[46], XLXN_21[47], XLXN_21[48], XLXN_21[49], XLXN_21[50], XLXN_21[51], XLXN_21[52], XLXN_21[53], XLXN_21[54], XLXN_21[55], XLXN_21[56], XLXN_21[57], XLXN_21[58], XLXN_21[59], XLXN_21[60], XLXN_21[61], XLXN_21[62], XLXN_21[63]}),
    .keyOut({XLXN_56[0], XLXN_56[1], XLXN_56[2], XLXN_56[3], XLXN_56[4], XLXN_56[5], XLXN_56[6], XLXN_56[7], XLXN_56[8], XLXN_56[9], XLXN_56[10], XLXN_56[11], XLXN_56[12], XLXN_56[13], XLXN_56[14], XLXN_56[15], XLXN_56[16], XLXN_56[17], XLXN_56[18], XLXN_56[19], XLXN_56[20], XLXN_56[21], XLXN_56[22], XLXN_56[23], XLXN_56[24], XLXN_56[25], XLXN_56[26], XLXN_56[27], XLXN_56[28], XLXN_56[29], XLXN_56[30], XLXN_56[31], XLXN_56[32], XLXN_56[33], XLXN_56[34], XLXN_56[35], XLXN_56[36], XLXN_56[37], XLXN_56[38], XLXN_56[39], XLXN_56[40], XLXN_56[41], XLXN_56[42], XLXN_56[43], XLXN_56[44], XLXN_56[45], XLXN_56[46], XLXN_56[47], XLXN_56[48], XLXN_56[49], XLXN_56[50], XLXN_56[51], XLXN_56[52], XLXN_56[53], XLXN_56[54], XLXN_56[55], XLXN_56[56], XLXN_56[57], XLXN_56[58], XLXN_56[59], XLXN_56[60], XLXN_56[61], XLXN_56[62], XLXN_56[63]}),
    .CE(CE));
  keySyncReg XLXI_18 (
    .clk(Clk_50MHz),
    .keyIn({XLXN_18[0], XLXN_18[1], XLXN_18[2], XLXN_18[3], XLXN_18[4], XLXN_18[5], XLXN_18[6], XLXN_18[7], XLXN_18[8], XLXN_18[9], XLXN_18[10], XLXN_18[11], XLXN_18[12], XLXN_18[13], XLXN_18[14], XLXN_18[15], XLXN_18[16], XLXN_18[17], XLXN_18[18], XLXN_18[19], XLXN_18[20], XLXN_18[21], XLXN_18[22], XLXN_18[23], XLXN_18[24], XLXN_18[25], XLXN_18[26], XLXN_18[27], XLXN_18[28], XLXN_18[29], XLXN_18[30], XLXN_18[31], XLXN_18[32], XLXN_18[33], XLXN_18[34], XLXN_18[35], XLXN_18[36], XLXN_18[37], XLXN_18[38], XLXN_18[39], XLXN_18[40], XLXN_18[41], XLXN_18[42], XLXN_18[43], XLXN_18[44], XLXN_18[45], XLXN_18[46], XLXN_18[47], XLXN_18[48], XLXN_18[49], XLXN_18[50], XLXN_18[51], XLXN_18[52], XLXN_18[53], XLXN_18[54], XLXN_18[55], XLXN_18[56], XLXN_18[57], XLXN_18[58], XLXN_18[59], XLXN_18[60], XLXN_18[61], XLXN_18[62], XLXN_18[63]}),
    .keyOut({XLXN_20[0], XLXN_20[1], XLXN_20[2], XLXN_20[3], XLXN_20[4], XLXN_20[5], XLXN_20[6], XLXN_20[7], XLXN_20[8], XLXN_20[9], XLXN_20[10], XLXN_20[11], XLXN_20[12], XLXN_20[13], XLXN_20[14], XLXN_20[15], XLXN_20[16], XLXN_20[17], XLXN_20[18], XLXN_20[19], XLXN_20[20], XLXN_20[21], XLXN_20[22], XLXN_20[23], XLXN_20[24], XLXN_20[25], XLXN_20[26], XLXN_20[27], XLXN_20[28], XLXN_20[29], XLXN_20[30], XLXN_20[31], XLXN_20[32], XLXN_20[33], XLXN_20[34], XLXN_20[35], XLXN_20[36], XLXN_20[37], XLXN_20[38], XLXN_20[39], XLXN_20[40], XLXN_20[41], XLXN_20[42], XLXN_20[43], XLXN_20[44], XLXN_20[45], XLXN_20[46], XLXN_20[47], XLXN_20[48], XLXN_20[49], XLXN_20[50], XLXN_20[51], XLXN_20[52], XLXN_20[53], XLXN_20[54], XLXN_20[55], XLXN_20[56], XLXN_20[57], XLXN_20[58], XLXN_20[59], XLXN_20[60], XLXN_20[61], XLXN_20[62], XLXN_20[63]}),
    .CE(CE));
  keySyncReg XLXI_19 (
    .clk(Clk_50MHz),
    .keyIn({XLXN_56[0], XLXN_56[1], XLXN_56[2], XLXN_56[3], XLXN_56[4], XLXN_56[5], XLXN_56[6], XLXN_56[7], XLXN_56[8], XLXN_56[9], XLXN_56[10], XLXN_56[11], XLXN_56[12], XLXN_56[13], XLXN_56[14], XLXN_56[15], XLXN_56[16], XLXN_56[17], XLXN_56[18], XLXN_56[19], XLXN_56[20], XLXN_56[21], XLXN_56[22], XLXN_56[23], XLXN_56[24], XLXN_56[25], XLXN_56[26], XLXN_56[27], XLXN_56[28], XLXN_56[29], XLXN_56[30], XLXN_56[31], XLXN_56[32], XLXN_56[33], XLXN_56[34], XLXN_56[35], XLXN_56[36], XLXN_56[37], XLXN_56[38], XLXN_56[39], XLXN_56[40], XLXN_56[41], XLXN_56[42], XLXN_56[43], XLXN_56[44], XLXN_56[45], XLXN_56[46], XLXN_56[47], XLXN_56[48], XLXN_56[49], XLXN_56[50], XLXN_56[51], XLXN_56[52], XLXN_56[53], XLXN_56[54], XLXN_56[55], XLXN_56[56], XLXN_56[57], XLXN_56[58], XLXN_56[59], XLXN_56[60], XLXN_56[61], XLXN_56[62], XLXN_56[63]}),
    .keyOut(keyOut), .CE(CE));
endmodule
